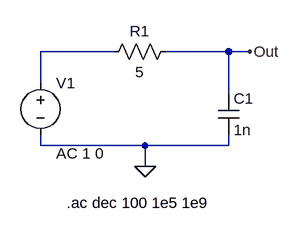
[diagram p0: schematic LowPassFilterBasic.asc]
LowPassFilterBasic.asc, the LTspice schematic file:
Version 4
SHEET 1 880 680
WIRE 144 80 32 80
WIRE 320 80 224 80
WIRE 352 80 320 80
WIRE 32 128 32 80
WIRE 320 144 320 80
WIRE 32 224 32 208
WIRE 192 224 32 224
WIRE 320 224 320 208
WIRE 320 224 192 224
WIRE 192 256 192 224
FLAG 192 256 0
FLAG 352 80 Out
SYMBOL voltage 32 112 R0
WINDOW 123 24 124 Left 2
WINDOW 39 0 0 Left 0
SYMATTR Value2 AC 1 0
SYMATTR InstName V1
SYMATTR Value ""
SYMBOL res 240 64 R90
WINDOW 0 0 56 VBottom 2
WINDOW 3 32 56 VTop 2
SYMATTR InstName R1
SYMATTR Value 5
SYMBOL cap 304 144 R0
SYMATTR InstName C1
SYMATTR Value 1n
TEXT 72 312 Left 2 !.ac dec 100 1e5 1e9

The netlist it stands for:
* LowPassFilterBasic.asc
V1 N001 0 AC 1 0
R1 Out N001 5
C1 Out 0 1n
.ac dec 100 1e5 1e9
.backanno
.end